# EAGLE design hw (EAGLE 9.5.1)
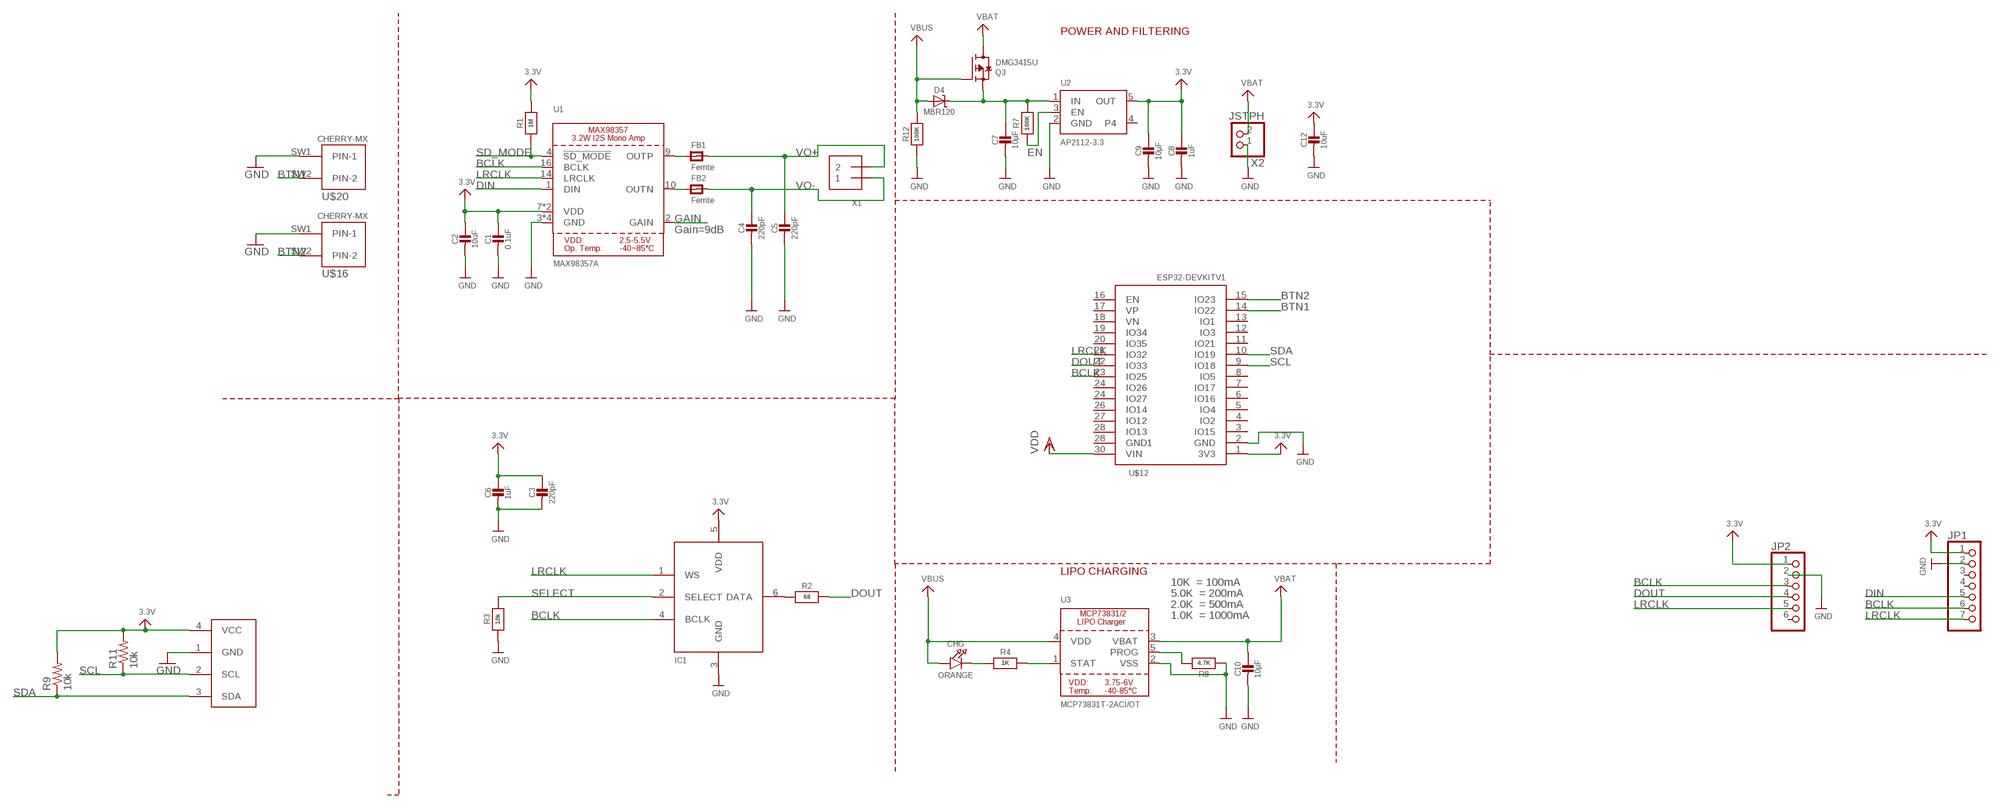
[diagram p0: schematic, sheet 1]

## Parts
C1  0.1uF  CAP_CERAMIC0805-NOOUTLINE  [0805-NO]
C2  10uF  CAP_CERAMIC0805-NOOUTLINE  [0805-NO]
C3  220pF  CAP_CERAMIC0805-NOOUTLINE  [0805-NO]
C4  220pF  CAP_CERAMIC0805-NOOUTLINE  [0805-NO]
C5  220pF  CAP_CERAMIC0805-NOOUTLINE  [0805-NO]
C6  1uF  CAP_CERAMIC0805-NOOUTLINE  [0805-NO]
C7  10µF  CAP_CERAMIC0805-NOOUTLINE  [0805-NO]
C8  1uF  CAP_CERAMIC0603_NO  [0603-NO]
C9  10µF  CAP_CERAMIC0805-NOOUTLINE  [0805-NO]
C10  10µF  CAP_CERAMIC0805-NOOUTLINE  [0805-NO]
C12  10uF  CAP_CERAMIC0805-NOOUTLINE  [0805-NO]
CHG  ORANGE  LED0805_NOOUTLINE  [CHIPLED_0805_NOOUTLINE]
D4  MBR120  DIODE-SCHOTTKYSOD-123  [SOD-123]
FB1  Ferrite  FERRITE-0805NO  [0805-NO]
FB2  Ferrite  FERRITE-0805NO  [0805-NO]
IC1  MIC_I2S_SPH0645  [SPH0645LM4H]
JP1  HEADER-1X7THICKER  [1X07_ROUND_76]
JP2  HEADER-1X6ROUND  [1X06_ROUND]
Q3  DMG3415U  MOSFET-P  [SOT23-R]
R1  1M  RESISTOR0805_NOOUTLINE  [0805-NO]
R2  68  RESISTOR_0603_NOOUT  [0603-NO]
R3  10k  RESISTOR_0603_NOOUT  [0603-NO]
R4  1K  RESISTOR_0603_NOOUT  [0603-NO]
R7  100K  RESISTOR_0603_NOOUT  [0603-NO]
R8  4.7K  RESISTOR_0603_NOOUT  [0603-NO]
R9  10k  R-US_R0805  [R0805]
R11  10k  R-US_R0805  [R0805]
R12  100K  RESISTOR_0603_NOOUT  [0603-NO]
U1  MAX98357A  AUDIOAMP_MAX98357  [QFN16_3MM]
U2  AP2112-3.3  VREG_SOT23-5  [SOT23-5]
U3  MCP73831T-2ACI/OT  MCP73831/2  [SOT23-5]
U$1  I2C_OLED  [I2C_OLED_PACKAGE]
U$12  ESP32DEVKITV1  [ESP32-DEVKITV1]
U$16  CHERRY-MX  [CHERRY-MX]
U$20  CHERRY-MX  [CHERRY-MX]
X1  TERMBLOCK_1X2  [TERMBLOCK_1X2-3.5MM]
X2  JSTPH  CON_JST_PH_2PIN  [JSTPH2]

## Nets
3.3V: C1.1 C2.1 C3.1 C6.1 C8.1 C9.1 C12.1 IC1.5(VDD) JP1.1 JP2.1 R1.2 R9.2 R11.2 U1.7(VDD) U1.8(VDD) U2.5(OUT) U$1.4(VCC) U$12.1(3V3)
BCLK: IC1.4(BCLK) JP1.6 JP2.3 U1.16(BCLK) U$12.23(IO25)
BTN1: U$12.14(IO22) U$20.SW2(PIN-2)
BTN2: U$12.15(IO23) U$16.SW2(PIN-2)
DIN: JP1.5 U1.1(DIN)
DOUT: JP2.4 R2.2 U$12.22(IO33)
EN: R7.1 U2.3(EN)
GAIN: U1.2(GAIN)
GND: C1.2 C2.2 C3.2 C4.2 C5.2 C6.2 C7.2 C8.2 C9.2 C10.2 C12.2 IC1.3(GND) JP1.2 JP2.2 R3.1 R8.1 R12.1 U1.3(GND) U1.11(GND) U1.15(GND) U1.THERMAL(GND) U2.2(GND) U3.2(VSS) U$1.1(GND) U$12.2(GND) U$16.SW1(PIN-1) U$20.SW1(PIN-1) X2.1
LRCLK: IC1.1(WS) JP1.7 JP2.5 U1.14(LRCLK) U$12.21(IO32)
N$1: IC1.6(DATA) R2.1
N$2: CHG.C R4.1
N$3: R4.2 U3.1(STAT)
N$4: R8.2 U3.5(PROG)
N$5: FB2.1 U1.10(OUTN)
N$6: FB1.1 U1.9(OUTP)
N$9: C7.1 D4.C Q3.2(S) R7.2 U2.1(IN)
SCL: R11.1 U$1.2(SCL) U$12.9(IO18)
SD_MODE: R1.1 U1.4(!SD_MODE)
SDA: R9.1 U$1.3(SDA) U$12.10(IO19)
SELECT: IC1.2(SELECT) R3.2
VBAT: C10.1 Q3.3(D) U3.3(VBAT) X2.2
VBUS: CHG.A D4.A Q3.1(G) R12.2 U3.4(VDD)
VDD: U$12.30(VIN)
VO+: C5.1 FB1.2 X1.2
VO-: C4.1 FB2.2 X1.1
Unconnected: JP1.3 JP1.4 JP2.6 U2.4 U$12.3(IO15) U$12.4(IO2) U$12.5(IO4) U$12.6(IO16) U$12.7(IO17) U$12.8(IO5) U$12.11(IO21) U$12.12(IO3) U$12.13(IO1) U$12.16(EN) U$12.17(VP) U$12.18(VN) U$12.19(IO34) U$12.20(IO35) U$12.24(IO26) U$12.24(IO27) U$12.26(IO14) U$12.27(IO12) U$12.28(GND1) U$12.28(IO13)

## Notes on the sheet
- POWER AND FILTERING
- Gain=9dB
- LIPO CHARGING
- 10K  = 100mA
- 5.0K  = 200mA
- 2.0K  = 500mA
- 1.0K  = 1000mA

## Library data of the parts
C1-C10 C12 = microbuilder:CAP_CERAMIC: Ceramic Capacitors For new designs, use the packages preceded by an '_' character since they are more reliable: The following footprints should be used on most boards: _0402 - Standard footprint for regular board layouts _0603 - Standard footprint for regular board layouts _0805 - Standard footprint for regular board layouts _1206 - Standard footprint for regular board layouts For extremely tight-pitch boards where space is at a premium, the following 'micro-pitch' footprints can be used (smaller pads, no silkscreen outline, etc.): _0402MP - Micro-pitch footprint for very dense/compact boards _0603MP - Micro-pitch footprint for very dense/compact boards _0805MP - Micro-pitch footprint for very dense/compact boards _1206MP - Micro-pitch footprint for very dense/compact boards
CHG = microbuilder:LED: LED 0603 - 0603 Surface Mount Package 2mA: Green LED - Low Power (3.9mcd, 2ma, 1.7Vf) - Digikey: 475-2709-2-ND Orange LED - Low Power (9.8mcd, 2ma, 1.8Vf) - Digikey: 475-1194-2-ND Red LED - Low Power (5mcd, 2ma, 1.8Vf) - Digikey: 475-1195-2-ND Yellow LED - Low Power (7mcd, 2ma, 1.8Vf) - Digikey: 475-1196-2-ND 5mA: Blue LED - Low Power (17mcd, 5ma, 2.9Vf) - Digikey: LNJ937W8CRACT-ND 0805 - 0805 Surface Mount Package 2mA: Red LED (8.8mcd, 2mA, 1.8Vf, Clear) - Low Power [Digikey: 475-2510-1-ND] Green LED (5mcd, 2mA, 1.8Vf, Clear) - Low Power [Digikey: 475-2730-1-ND] Yellow LED (11.3mcd, 2mA, 1.8Vf, Clear) - Low Power [Digikey: 475-2555-1-ND] 20mA: Red LED (104mcd, 20mA, Diffused) - LS R976 [Digikey: 475-1278-6-ND] Red LED (12mcd, 20mA, 2.0Vf, Clear) - APT2012EC [Digikey: 754-1128-1-ND] Green LED (15mcd, 20mA, 2.2Vf, Clear) - APT2012GC [Digikey: 754-1131-1-ND] Orange LED (160mcd, 20mA, 2.1Vf, Clear) - APT2012SECK [Digikey: 754-1130-1-ND] 1206 - 1206 Surface Mount Package Green LED (26mcd, 20mA, Diffused) - LG N971 [Digikey: 475-1407-6-ND] Red LED (15mcd, 20mA, Diffused) - LH N974 [Digikey: 475-1416-6-ND] Cree - Cree High-Power Surface Mount LEDs XPEBWT-L1-0000-00D50 - White 111lm 350mA 2.9Vf 6200K 110° XTEAWT-00-0000-00000LEE3 - White 114lm 350mA 2.85Vf 5000K 115° Everlight - Everlight 45-21 Series Surface Mount LEDs 45-21/QK2C-B2832AC2CB2/2T - Warm White 2000mcd 20mA 3.25Vf 3050K 120° 45-21/LK2C-B38452C4CB2/2T - Nuetral White 2000mcd 20mA 3.25Vf 4150K 120° 45-21/LK2C-B50634C6CB2/2T - Cold White 2200mcd 20mA 3.25Vf 5650K 120° PLCC2 Reverse Mount LS T77K-J1L2-1-0-2-R18-Z - Red 11.25mcd 2mA 1.8Vf 630nm 120° LO T77K-L1M2-24-Z - Orange 19.6mcd 2mA 1.8Vf 606nm 120° LY T77K-K2M1-26-Z - Yellow 15.7mcd 2mA 1.8Vf 587nm 120°
D4 = microbuilder:DIODE-SCHOTTKY
FB1 FB2 = microbuilder:FERRITE: Ferrite Bead 0603 MMZ1608B121C - 120 Ohm @ 100MHz, 600mA, 0.15 Ohm DC Resistance - Digikey: 445-2164-1-ND BK1608HW121-T - 120 Ohm, 600mA Ferrite Chip - Digikey: 587-1876-2-ND 0805 HZ0805B272R-10 - 2.7K Ohm @ 100MHz, 200mA, 0.8 Ohm DC Resistance - Digikey: 240-2504-1-ND (see also Murata BLM21BD272SN1L) MMZ2012Y152B - 1.5K Ohm @ 100MHz, 500mA, 0.4 Ohm DC Resistance - Digikey: 445-1560-1-ND - Mainly for high frequency (80-400MHz) MMZ2012R102A - 1K Ohm @ 100MHz, 500mA, 0.3 Ohm DC Resistance - Digikey: 445-1555-2-ND - More general purpose (10-200MHz)
IC1 = microbuilder:MIC_I2S
JP1 = microbuilder:HEADER-1X7: PIN HEADER
JP2 = microbuilder:HEADER-1X6: PIN HEADER
Q3 = microbuilder:MOSFET-P: P-Channel Mosfet LEGEND VDS: Voltage Drain-Source ID: Drain Current RDS(ON): Drain-Source On-State Resistance VGS(TH): Gate-Source Threshold Voltage CISS: Drain-Source Input Capacitance SOT-23 Name VDS ID RDS(ON) VGS(TH) CISS Order Number IRLML5103 30V 760mA 600 mOhm -- 75pF @ 25V Digikey: IRLML5103PBFCT-ND IRLML6401 12V 4.3A 50 mOhm 950mV @ 250µA 830pF @ 10V Digikey: IRLML6401PBFTR-ND NTR0202PL 20V 400mA 800 mOhm 2.3V @ 250uA 70pF @ 5V Digikey: NTR0202PLT1GOSTR-ND NTR4101PT1G 20V 1.8A 85 mOhm 1.2V @ 250uA 675pF @ 10V Digikey: NTR4101PT1GOSCT-ND DMP2004K 20V 600mA 900 mOhm 1V @ 250uA 175pF @ 16V Digikey: DMP2004KDICT-ND PMV65XP 20V 3.9A 76 mOhm 950mV @ 1mA 725pF @ 20V Digikey: 568-2358-2-ND TO-252 Name VDS ID RDS(ON) VGS(TH) CISS Order Number AOD417 30V 25A 34 mOhm 3V @ 250µA 920pF @ 15V Digikey: 785-1106-2-ND PowerPak Name VDS ID RDS(ON) VGS(TH) CISS Order Number AON7401 30V 12A 14 mOhm 3V @ 250µA 2600pF @ 15V Digikey: 785-1302-1-ND
R1-R4 R7 R8 R12 = microbuilder:RESISTOR: Resistors For new designs, use the packages preceded by an '_' character since they are more reliable: The following footprints should be used on most boards: _0402 - Standard footprint for regular board layouts _0603 - Standard footprint for regular board layouts _0805 - Standard footprint for regular board layouts _1206 - Standard footprint for regular board layouts For extremely tight-pitch boards where space is at a premium, the following 'micro-pitch' footprints can be used (smaller pads, no silkscreen outline, etc.): _0402MP - Micro-pitch footprint for very dense/compact boards _0603MP - Micro-pitch footprint for very dense/compact boards _0805MP - Micro-pitch footprint for very dense/compact boards _1206MP - Micro-pitch footprint for very dense/compact boards
R9 R11 = rcl:R-US_: RESISTOR, American symbol; SPICEPREFIX: R
U1 = microbuilder:AUDIOAMP_MAX98357: MAX98357 - 3.2W I2S Mono Audio Amp
U2 = microbuilder:VREG_SOT23-5: SOT23-5 Fixed Voltage Regulators Part Current Out V Out V In V Dropout θJA (°C/W) TJ (°C) Digikey Part No. ADP121 150mA 3.3V 3.4-5.5V 0.09V @ 150mA -- -- ADP121-AUJZ33R7CT-ND ADP121 150mA 3.0V 3.1-5.5V 0.09V @ 150mA -- -- ADP121-AUJZ30R7CT-ND ADP122 300mA 3.3V 3.4-5.5V 0.085V @ 300mA -- -- ADP122AUJZ-3.3-R7CT-ND ADP1712 300mA 3.3V 3.5-5.5V 0.17V @ 300mA -- -- ADP1712AUJZ-3.3-R7TR-ND AP7311 (Low Cost) 150mA 3.3V 3.5-6V 0.15V @ 150mA -- -- AP7311-33WG-7DICT-ND LD39015M18R 150mA 1.8V 1.9V-5.5V 0.08V @ 100mA -- -- 497-6977-1-ND LP2985A-33DBVR 150mA 3.3V 3.3-16V 0.28V @ 150mA 206 150 296-18479-1-ND MCP1824T-3302E/OT 300mA 3.3V 3.5V-6V 0.2V @ 300mA -- -- MCP1824T-3302E/OTCT-ND MIC5205-2.5YM5 TR 150mA 2.5V 2.7-16V 0.165V @ 150mA -- -- 576-1257-2-ND MIC5205-3.0YM5 TR 150mA 3.0V 3.2V-16V 0.165V @ 150mA -- -- 576-1258-2-ND MIC5205-3.3YM5 TR 150mA 3.3V 3.5V-16V 0.165V @ 150mA -- -- 576-1259-2-ND TPS780330220 150mA 3.3V+2.2V 3.6-5.5V 250mV Max -- -- 296-23332-1-ND TDA3663/N1,135 100mA 3.3V 3.5-45V 0.18V @ 50mA -- -- 568-5343-1-ND Max operating temp can be calculated using θJA, TJ (max junction temperature), and power in watts. Set the "Maximum Ambient Temperature" until it reaches TJ ("Max Junction Temperature"), which is the absolute limit for safe use of the regulator: Heat Sink Temperature Calculator <http://www.daycounter.com/Calculators/Heat-Sink-Temperature-Calculator.phtml> For example, With 12V source into a 3.3V LP2985 and a 30mA load, we are dissipating (12V-3.3V) * 0.03A = 0.261W. With a θJA of 206 °C/W, a TJ of 150°C, and 261mW we can safely use the chip without a heat sink up to 75°C (=147.1°C Junction Temperature).
U3 = microbuilder:MCP73831/2: MCP73831/2 LIPO Charger VDD: 3.75 - 6V Temp -40 - 85°C Programmable Charge Rate: 15-500mA NOTE: STAT is a tri-state logic output on the MCP73831 and an open-drain output on the MCP73832. SOT23-5 with 4.2V output and tri-state logic on STAT = MCP73831T-2ACI/OT
U$1 = DIYMall_OLED:I2C_OLED
U$12 = ESP32-DEVKITV1:ESP32DEVKITV1
U$16 U$20 = cherrymx:CHERRY-MX: Cherry MX series keyswitch
X1 = microbuilder:TERMBLOCK_1X2: 3.5mm Terminal block http://www.ladyada.net/library/pcb/eaglelibrary.html
X2 = microbuilder:CON_JST_PH_2PIN: JST 2-Pin Right-Angle Connector PH-Series - 4UConnector: 17311 SH-Series - 4UConnector: 07278

## Board
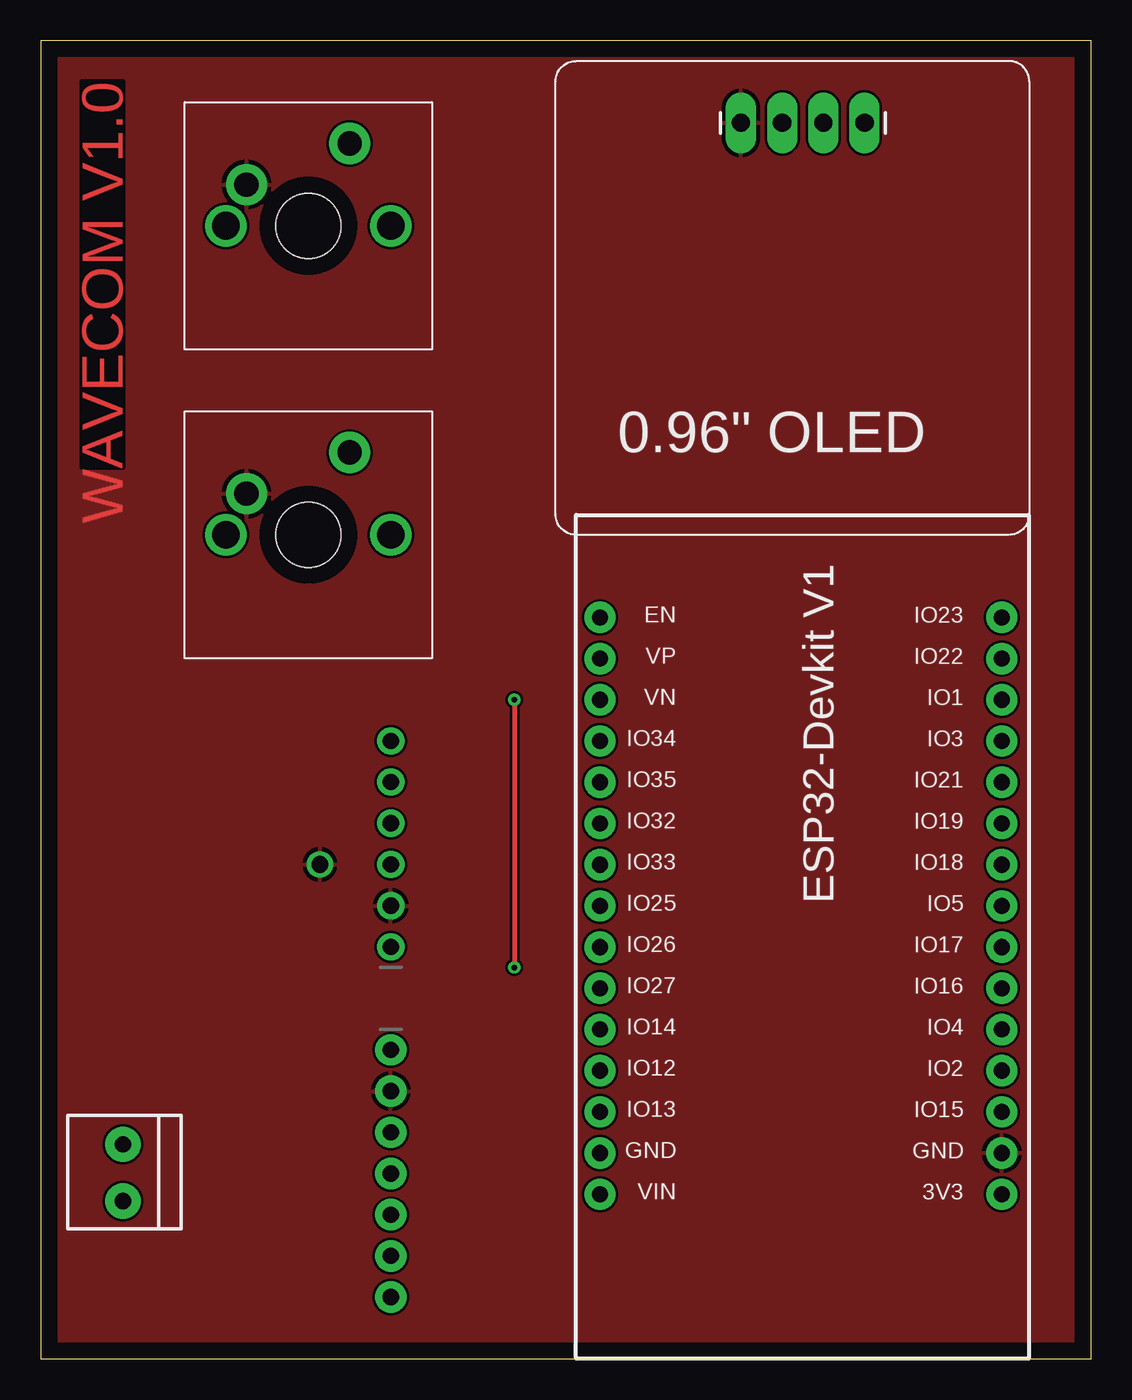
[diagram p1: board, top side]
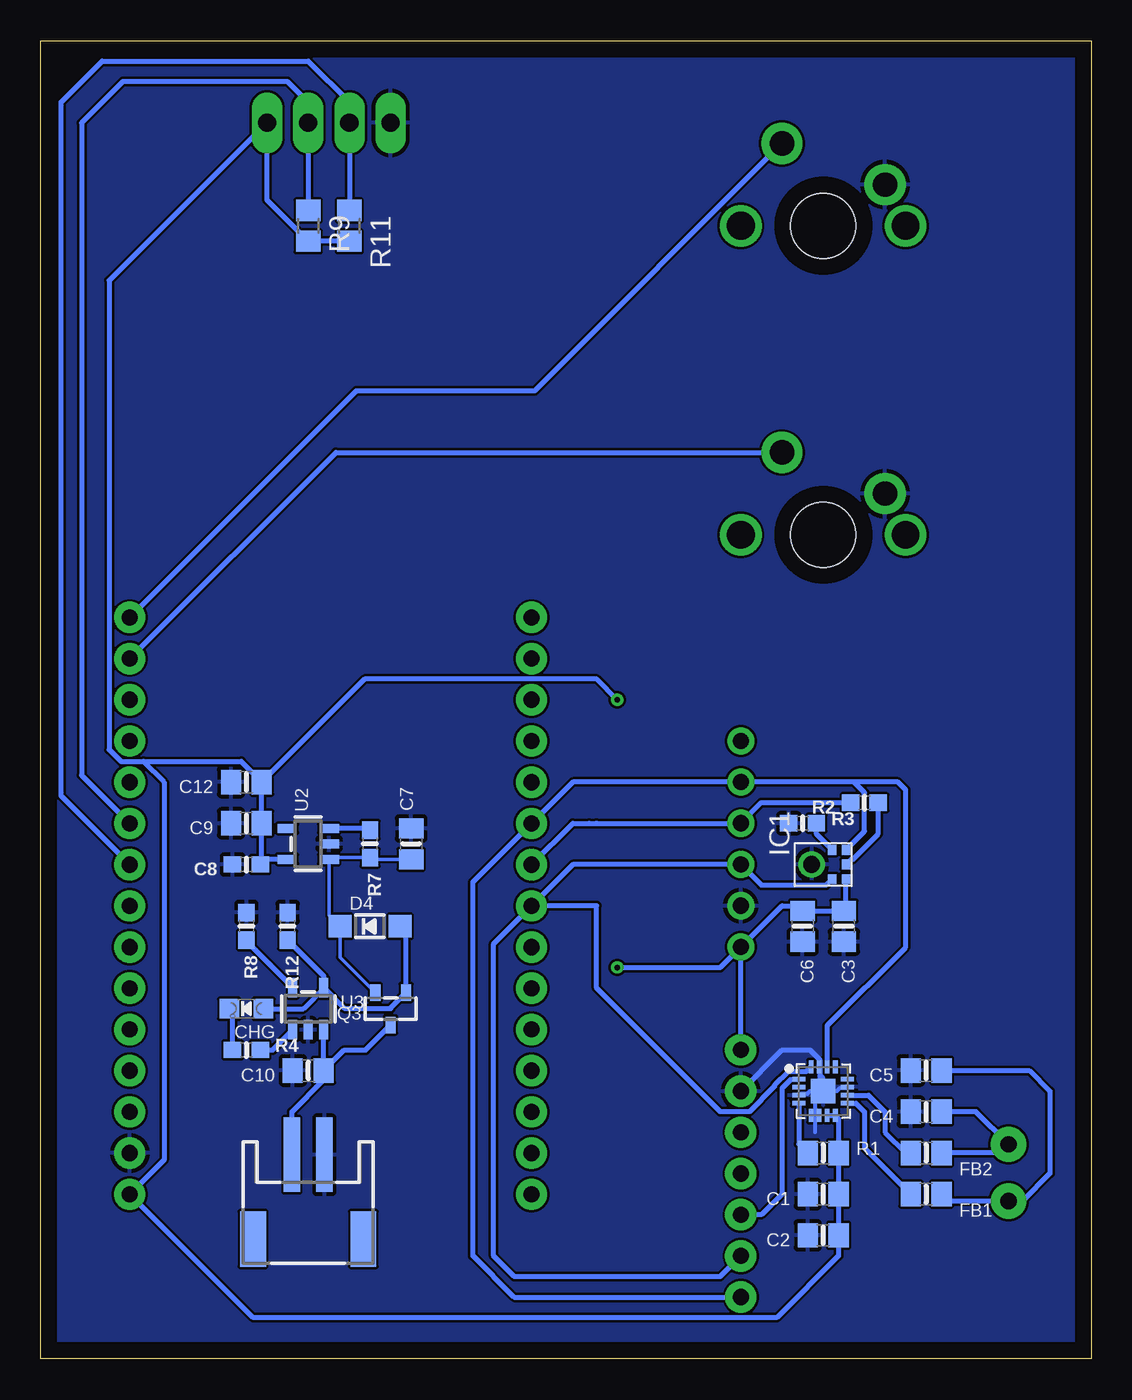
[diagram p2: board, bottom side, seen from below]

Size 64.76 x 81.27 mm. Coordinates in mm from the lower left corner, seen from the top.
Outline: 0,0 64.76,0 64.76,81.27 0,81.27 0,0
Copper layers (1*16): Top 0.035mm / dielectric 1.5mm / Bottom 0.035mm
Design rules "default": minimum track width 6mil, minimum drill 0.35mm, track to track 6mil, track to pad 6mil, pad to pad 6mil, via to via 6mil, smd to smd 6mil, copper to edge 40mil, drill to drill 6mil, minimum pad ring 10mil, minimum via ring 8mil, stop-mask expansion 4mil, vias tented up to drill 0mil, thermal gap 10mil

### Footprints (pad centres in the part's own frame; a part is rotated, then mirrored left to right if it is on the bottom)
0805-NO = smd 1.24 x 1.5: 1 -0.95,0; 2 0.95,0
0603-NO = smd 1.075 x 1: 1 -0.85,0; 2 0.85,0
CHIPLED_0805_NOOUTLINE = smd 1.2 x 1.2: A 0,-1.05; C 0,1.05
SOD-123 = smd 1.4 x 1.4: A 1.85,0; C -1.85,0
SPH0645LM4H = smd 0.6 x 0.525: 1 -0.9,1.4; 2 -0.9,0.55; 4 0.9,0.55; 5 0.9,1.4; 6 0,1.4 | drill 1.025 pad 1.625: 3 0,-0.71
1X07_ROUND_76 = drill 1 pad 1.93: 1 -7.62,0; 2 -5.08,0; 3 -2.54,0; 4 0,0; 5 2.54,0; 6 5.08,0; 7 7.62,0
1X06_ROUND = drill 1 pad 1.676: 1 -6.35,0; 2 -3.81,0; 3 -1.27,0; 4 1.27,0; 5 3.81,0; 6 6.35,0
SOT23-R = smd 0.635 x 1.016: 1 -0.95,-1; 2 0.95,-1; 3 0,1
R0805 = smd 1.3 x 1.5: 1 -0.95,0; 2 0.95,0
QFN16_3MM = smd 0.8 x 0.28: 1 -1.5,0.75; 2 -1.5,0.25; 3 -1.5,-0.25; 4 -1.5,-0.75; 9 1.5,-0.75; 10 1.5,-0.25; 11 1.5,0.25; 12 1.5,0.75 | smd 0.28 x 0.8: 5 -0.75,-1.5; 6 -0.25,-1.5; 7 0.25,-1.5; 8 0.75,-1.5; 13 0.75,1.5; 14 0.25,1.5; 15 -0.25,1.5; 16 -0.75,1.5 | smd 1.5 x 1.5: THERMAL 0,0
SOT23-5 = smd 0.55 x 1.2: 1 -0.95,-1.3; 2 0,-1.3; 3 0.95,-1.3; 4 0.95,1.3; 5 -0.95,1.3
I2C_OLED_PACKAGE = drill 1.118 pad 1.88 long: 1 0,0; 2 2.54,0; 3 5.08,0; 4 7.62,0
ESP32-DEVKITV1 = drill 1 pad 1.93: 1 -22.87,-13.54; 2 -20.33,-13.54; 3 -17.79,-13.54; 4 -15.25,-13.54; 5 -12.71,-13.54; 6 -10.17,-13.54; 7 -7.63,-13.54; 8 -5.09,-13.54; 9 -2.55,-13.54; 10 -0.01,-13.54; 11 2.53,-13.54; 12 5.07,-13.54; 13 7.61,-13.54; 14 10.15,-13.54; 15 12.69,-13.54; 16 12.69,11.23; 17 10.15,11.23; 18 7.61,11.23; 19 5.07,11.23; 20 2.53,11.23; 21 -0.01,11.23; 22 -2.55,11.23; 23 -5.09,11.23; 24 -7.63,11.23; 25 -10.17,11.23; 26 -12.71,11.23; 27 -15.25,11.23; 28 -17.79,11.23; 29 -20.33,11.23; 30 -22.87,11.23
CHERRY-MX = drill 1.714 pad 1.93: P$3 -5.08,0; P$4 5.08,0 | drill 1.5 pad 2.54: SW1 -3.81,2.54; SW2 2.54,5.08 | hole 4: 0,0
TERMBLOCK_1X2-3.5MM = drill 1 pad 2.184: 1 1.8,0; 2 -1.7,0
JSTPH2 = smd 1 x 4.6: 1 -1,-3.7; 2 1,-3.7 | smd 1.6 x 3.4: NC1 -3.4,1.5; NC2 3.4,1.5

### Placement (x,y rotation side)
C1  16.51,10.16 180 bottom
C2  16.51,7.62 180 bottom
C3  15.24,26.67 270 bottom
C4  10.16,15.24 180 bottom
C5  10.16,17.78 180 bottom
C6  17.78,26.67 270 bottom
C7  41.91,31.75 90 bottom
C8  52.07,30.48 180 bottom
C9  52.07,33.02 180 bottom
C10  48.26,17.78 180 bottom
C12  52.07,35.56 180 bottom
CHG  52.07,21.59 90 bottom
D4  44.45,26.67 0 bottom
FB1  10.16,10.16 0 bottom
FB2  10.16,12.7 0 bottom
IC1  16.51,30.48 270 bottom
JP1  21.59,11.43 270 top
JP2  21.59,31.75 90 top
Q3  43.18,21.59 180 bottom
R1  16.51,12.7 0 bottom
R2  13.97,34.29 180 bottom
R3  17.78,33.02 0 bottom
R4  52.07,19.05 0 bottom
R7  44.45,31.75 270 bottom
R8  52.07,26.67 270 bottom
R9  48.26,69.85 270 bottom
R11  45.72,69.85 270 bottom
R12  49.53,26.67 270 bottom
U1  16.51,16.51 0 bottom
U2  48.26,31.75 90 bottom
U3  48.26,21.59 0 bottom
U$1  43.18,76.2 0 top
U$12  45.72,33.02 90 top
U$16  16.51,69.85 0 top
U$20  16.51,50.8 0 top
X1  5.08,11.43 90 top
X2  48.26,8.89 180 bottom

### Tracks (layer width: path | path; a pad name or v marks a point on that pad's centre or on a via)
3.3V  (via drill 0.35)
  Top 0.305: v29.21,40.64 v29.21,24.13
  Bottom 0.305: U2.5 50.9,30.8 C8.1 51.12,30.58 C9.1 C12.1 | U1.7 U1.8 15.56,14.81 R1.2 C1.1 C2.1 | 15.56,7.3 C2.1 | C2.1 15.56,6.35 19.37,2.54 51.65,2.54 U$12.1 57.15,12.26 57.15,35.56 58.42,36.83 | JP2.1 19.05,27.94 18.1,27.94 C6.1 C3.1 15.11,27.75 IC1.5 | JP2.1 22.86,24.13 v29.21,24.13 | v29.21,40.64 30.47,41.9 44.78,41.9 C12.1 | R11.2 R9.2 50.8,71.44 U$1.4 60.53,66.47 60.53,37.56 59.79,36.82 58.43,36.82 58.42,36.83 | 58.42,36.83 52.39,36.83 C12.1 | JP1.1 JP2.1
BCLK
  Bottom 0.305: IC1.4 16.33,29.21 20.32,29.21 JP2.3 31.94,30.48 U$12.23 | JP1.6 22.86,5.08 35.56,5.08 36.83,6.35 36.83,25.59 U$12.23 | U1.16 17.55,17.72 18.67,17.72 19.51,16.88 19.51,16.8 21.06,15.24 22.86,15.24 30.48,22.86 30.48,27.93 U$12.23
BTN1
  Bottom 0.305: U$12.14 46.55,55.88 U$20.SW2
BTN2
  Bottom 0.305: U$12.15 45.28,59.69 34.29,59.69 U$16.SW2
DIN
  Bottom 0.305: U1.1 18.06,17.2 18.54,17.2 19.05,16.69 19.05,10.16 20.32,8.89 JP1.5
DOUT
  Bottom 0.305: 30.92,33.02 30.48,33.02 | 30.48,33.02 JP2.4 20.32,34.29 R2.2 | U$12.22 31.95,33.01 30.49,33.01 30.48,33.02
EN
  Bottom 0.305: R7.1 44.55,32.7 U2.3
GND
  Bottom 0.254: U1.11 15.08,16.69 15.51,16.69 15.69,16.51 U1.THERMAL | U1.3 17.93,16.34 17.49,16.34 17.32,16.51 U1.THERMAL | U1.15 16.69,17.94 16.69,17.51 16.51,17.32 U1.THERMAL | U1.THERMAL 17.02,16 17.02,13.97
  Bottom 0.305: JP1.2 19.05,19.05 17.33,19.05 16.72,18.44 16.72,17.8 16.7,17.79 16.7,16.7 U1.THERMAL
  pour Bottom: 64.77,81.28 0,81.28 0,0 64.77,0
  pour Top: 0,81.28 64.77,81.28 64.77,0 0,0 0,72.39
LRCLK
  Bottom 0.305: IC1.1 13.97,32.52 13.97,34.91 14.62,35.56 | 14.62,35.56 JP2.5 31.94,35.56 U$12.21 38.1,29.4 38.1,6.35 35.56,3.81 JP1.7 | U1.14 16.26,20.55 11.43,25.38 11.43,35.09 11.9,35.56 14.62,35.56
N$1
  Bottom 0.305: IC1.6 14.81,30.77 14.72,30.77 13.12,32.38 R2.1
N$2
  Bottom 0.305: R4.1 52.92,21.39 CHG.C
N$3
  Bottom 0.305: R4.2 50.45,19.05 U3.1
N$4
  Bottom 0.305: U3.5 52.07,25.75 R8.2
N$5
  Bottom 0.305: U1.10 13.72,16.26 12.7,15.24 12.7,13.97 11.43,12.7 FB2.1
N$6
  Bottom 0.305: U1.9 14.49,15.76 13.97,15.24 13.97,13.02 FB1.1
N$9
  Bottom 0.203: C7.1 44.55,30.8 | R7.2 46.86,30.9 U2.1 46.96,27.33 D4.C 46.3,24.76 Q3.2
  Bottom 0.305: 44.55,30.8 R7.2 44.35,30.8
SCL
  Bottom 0.305: R11.1 U$1.2 45.72,77.47 48.26,80.01 60.96,80.01 63.5,77.47 63.5,34.71 U$12.9
SD_MODE
  Bottom 0.305: U1.4 18.01,13.25 R1.1
SDA
  Bottom 0.305: R9.1 U$1.3 48.26,77.47 49.53,78.74 59.69,78.74 62.23,76.2 62.23,35.98 U$12.10
SELECT
  Bottom 0.305: IC1.2 16.93,32.35 R3.2
VBAT
  Bottom 0.305: Q3.3 44.72,19.05 46.04,19.05 C10.1 | C10.1 U3.3 | 49.53,12.32 X2.2 49.26,15.24 47.31,17.19 C10.1
VBUS
  Bottom 0.305: 43.18,21.64 43.18,21.59 | 43.18,21.64 43.2,21.61 | 43.23,21.59 43.2,21.61 | CHG.A 48.55,21.59 47.28,22.86 U3.4 | R12.2 47.31,23.6 U3.4 | U3.4 46.03,21.61 43.2,21.61 | 43.18,21.64 Q3.1 42.23,26.3 D4.A
VO+
  Bottom 0.305: FB1.2 8.78,9.73 X1.2 4.24,9.73 2.54,11.43 2.54,16.51 3.81,17.78 C5.1
VO-
  Bottom 0.305: FB2.2 5.61,12.7 X1.1 7.09,15.24 C4.1
(copper drawn outside any net)
  shapes: Top area x1

### Text on the board
Top: WAVECOM V1.0